# EAGLE design working (EAGLE 7.7.0)
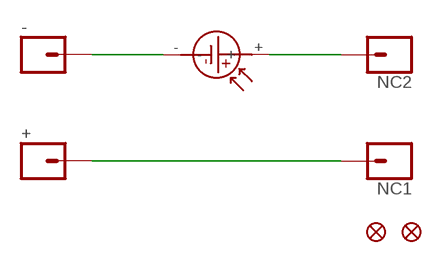
[diagram p0: schematic, sheet 1]

## Parts
+  CONN_01  [1X01]
-  CONN_01  [1X01]
FD1  FIDUCIALUFIDUCIAL  [FIDUCIAL-MICRO]
FD2  FIDUCIALUFIDUCIAL  [FIDUCIAL-MICRO]
NC1  CONN_01  [1X01]
NC2  CONN_01  [1X01]
U$1  9X20_AMORPHOUS_PV  [20X9MM]

## Nets
N$1: +.1 NC1.1
N$2: -.1 U$1.-
N$3: NC2.1 U$1.+

## Library data of the parts
+ - NC1 NC2 = SparkFun-Connectors:CONN_01: Single connection point. Often used as Generic Header-pin footprint for 0.1 inch spaced/style header connections On any of the 0.1 inch spaced packages, you can populate with these: Break Away Headers - Straight <https://www.sparkfun.com/products/116> (PRT-00116) Break Away Male Headers - Right Angle <https://www.sparkfun.com/products/553> (PRT-00553) Female Headers <https://www.sparkfun.com/products/115> (PRT-00115) Break Away Headers - Machine Pin <https://www.sparkfun.com/products/117> (PRT-00117) Break Away Female Headers - Swiss Machine Pin <https://www.sparkfun.com/products/743> (PRT-00743) This device is also useful as a general connection point to wire up your design to another part of your project. Our various solder wires solder well into these plated through hole pads. Hook-Up Wire - Assortment (Stranded, 22 AWG) <https://www.sparkfun.com/products/11375> (PRT-11375) Hook-Up Wire - Assortment (Solid Core, 22 AWG) <https://www.sparkfun.com/products/11367> (PRT-11367) View the entire wire category on our website here <https://www.sparkfun.com/categories/141> Special notes: SMTSO-256-ET is a "flush mount" nut for a 4-40 screw. We mostly use this on specialty testbeds; it is a nice way to connect hardware to your PCB at an adjustable hieght. Also note, the SNAP packages are for using a snappable style connector. We sell a baggie of snaps and they are also used on two LilyPad designs: Snap Assortment - 30 pack (male and female) <https://www.sparkfun.com/products/11347> (DEV-11347) LilyPad Arduino SimpleSnap <https://www.sparkfun.com/products/10941> (DEV-10941) LilyPad SimpleSnap Protoboard <https://www.sparkfun.com/products/10940> (DEV-10940)
FD1 FD2 = SparkFun-Aesthetics:FIDUCIAL: Fiducial Alignment Points Point-of-reference for pick-and-place machines and other optical instruments.
U$1 = SparkX:9X20_AMORPHOUS_PV

## Board
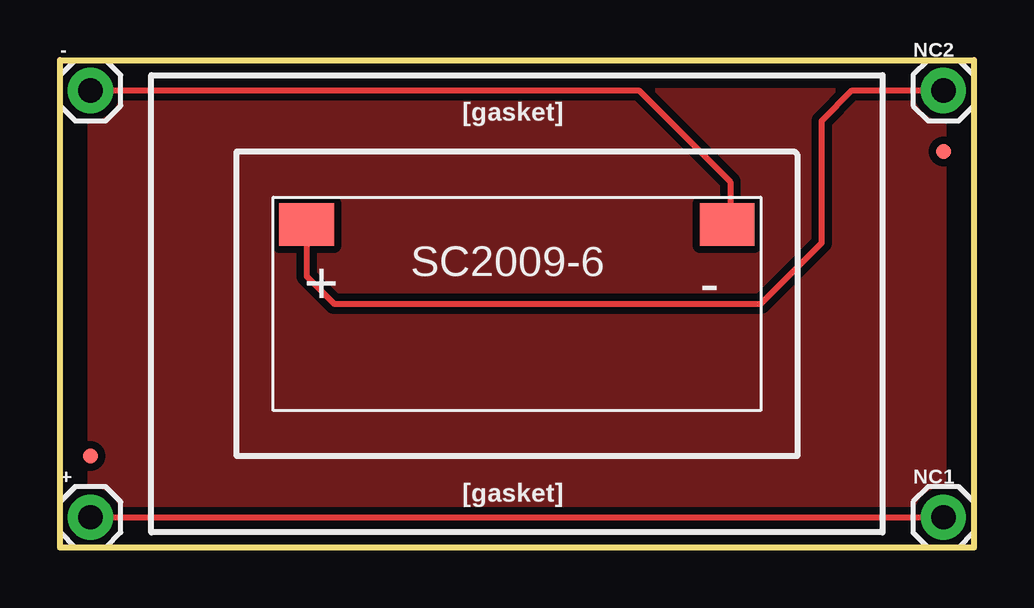
[diagram p1: board, top side]
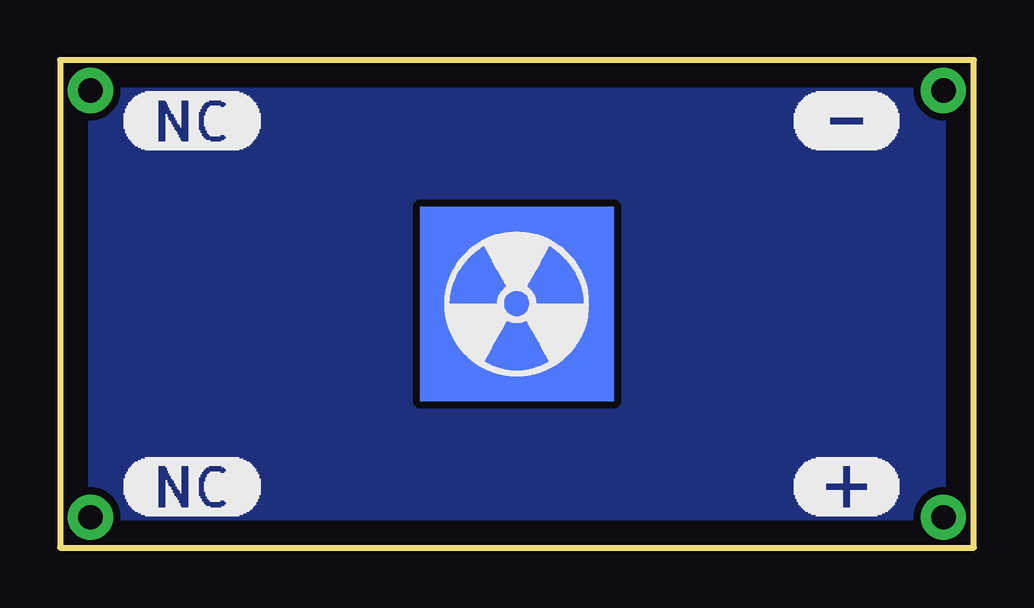
[diagram p2: board, bottom side, seen from below]

Size 38.1 x 20.32 mm. Coordinates in mm from the lower left corner, seen from the top.
Outline: 0,20.32 38.1,20.32 38.1,0 0,0 0,20.32
Copper layers (1*16): Top 0.035mm / dielectric 1.5mm / Bottom 0.035mm
Design rules "default": minimum track width 10mil, minimum drill 0.6mm, track to track 8mil, track to pad 8mil, pad to pad 8mil, via to via 8mil, smd to smd 8mil, copper to edge 40mil, drill to drill 8mil, minimum pad ring 10mil, minimum via ring 8mil, stop-mask expansion 4mil, vias tented up to drill 0mil, thermal gap 10mil

### Footprints (pad centres in the part's own frame; a part is rotated, then mirrored left to right if it is on the bottom)
1X01 = drill 1.016 pad 1.88: 1 0,0
FIDUCIAL-MICRO = smd 0.635 x 0.635: 1 0,0
20X9MM = smd 2.286 x 1.778: + -8.763,3.302; - 8.763,3.302

### Placement (x,y rotation side)
+  1.27,1.27 0 top
-  1.27,19.05 0 top
FD1  1.27,3.81 0 top
FD2  36.83,16.51 0 top
NC1  36.83,1.27 0 top
NC2  36.83,19.05 0 top
U$1  19.05,10.16 0 top
U$2  [#0]  7.62,2.54 0 bottom
U$3  [#1]  7.62,17.78 0 bottom
U$4  [NC0]  35.56,17.78 0 bottom
U$5  [RADIATION_TREFOIL_SIGN_SYMBOL_WARNING_SIGN_SYMBOL_CLASSIC_ROUND_STICKER#RCB13028D4AAD443CA303E61808FDC84C_V9WAF_8BYVR_540#JPG]  19.05,10.16 0 bottom
U$6  [NC0]  35.56,2.54 0 bottom

### Tracks (layer width: path | path; a pad name or v marks a point on that pad's centre or on a via)
N$1
  Top 0.254: +.1 NC1.1
N$2
  Top 0.254: -.1 24.13,19.05 27.94,15.24 27.94,13.59 U$1.-
N$3
  Top 0.254: U$1.+ 10.29,11.3 11.43,10.16 29.21,10.16 31.75,12.7 31.75,17.78 33.02,19.05 NC2.1
N$6
  pour Top (isolate 0.305): 0,20.32 38.1,20.32 38.1,0 0,0
N$7
  pour Bottom (isolate 0.305): 0,20.32 38.1,20.32 38.1,0 0,0

### Text on the board
tPlace: [gasket] | [gasket]